# Altium schematic sheet MODULE_CONTROL.SchDoc: MODULE CONTROL
size A3; Author: Silvio Navaretti; CompanyName: ARDUINO; Organization: ARDUINO; SheetNumber: 5; SheetTotal: 51; RevAuthor: Silvio Navaretti
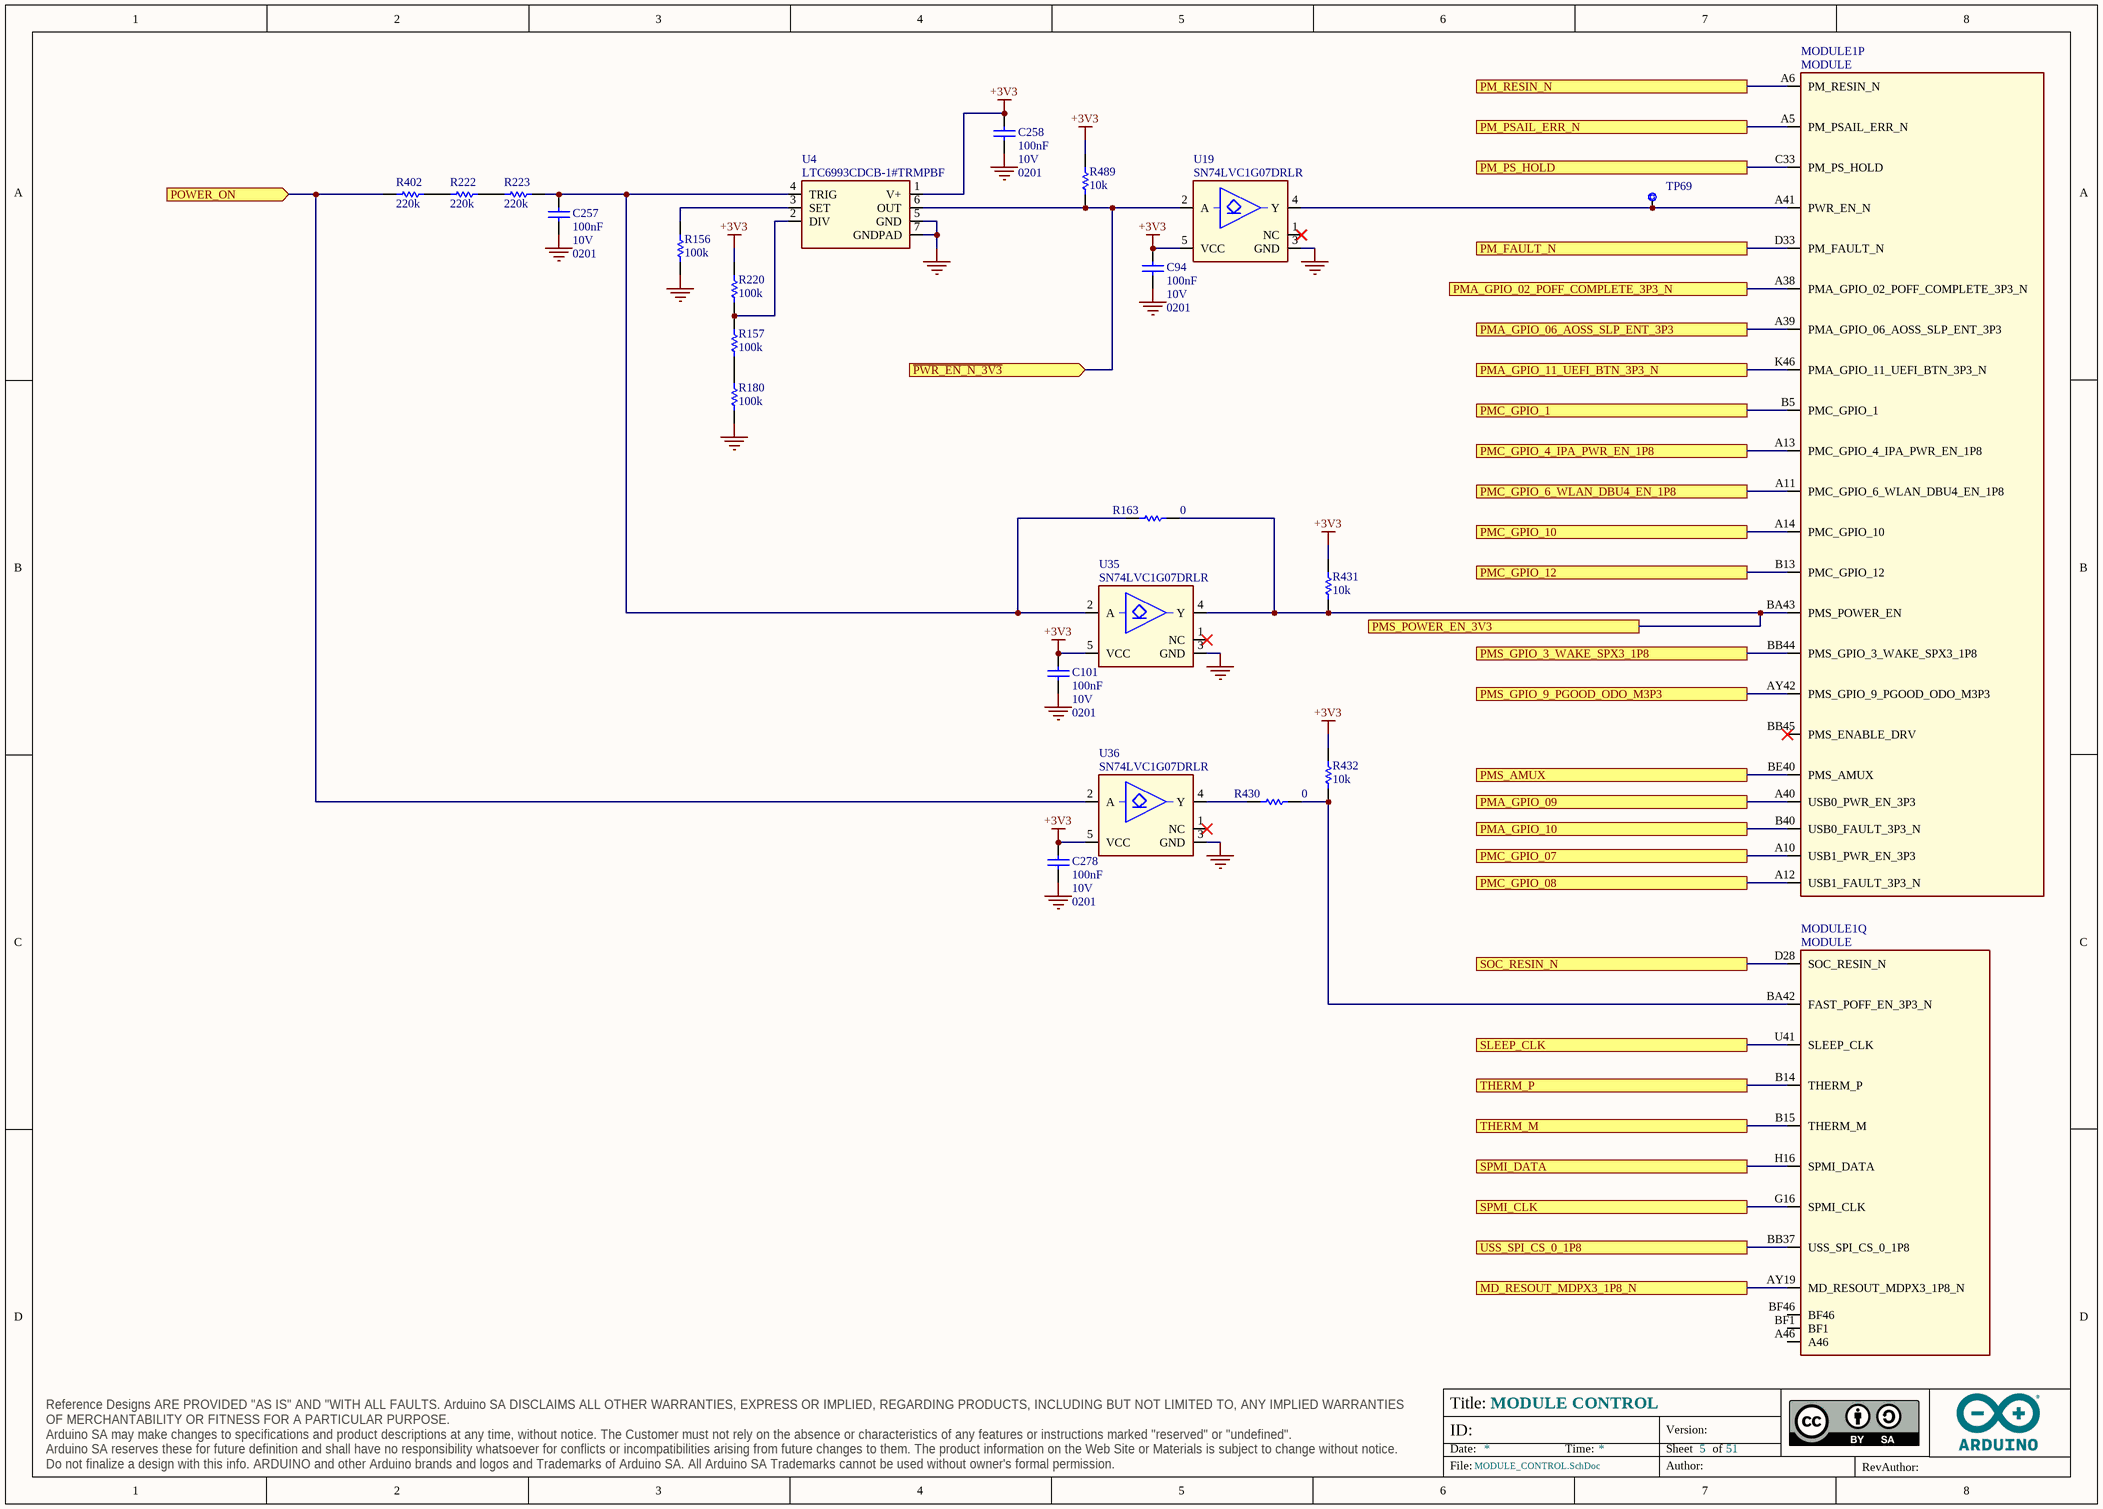
[diagram p0: MODULE_CONTROL.SchDoc]

## Parts
C94  value 100nF  Voltage: 10V  Case Code (Imperial): 0201  [CAP-0201]  (hidden comment: CL03A104KP3NNNC)
C101  value 100nF  Voltage: 10V  Case Code (Imperial): 0201  [CAP-0201]  (hidden comment: CL03A104KP3NNNC)
C257  value 100nF  Voltage: 10V  Case Code (Imperial): 0201  [CAP-0201]  (hidden comment: CL03A104KP3NNNC)
C258  value 100nF  Voltage: 10V  Case Code (Imperial): 0201  [CAP-0201]  (hidden comment: CL03A104KP3NNNC)
C278  value 100nF  Voltage: 10V  Case Code (Imperial): 0201  [CAP-0201]  (hidden comment: CL03A104KP3NNNC)
MODULE1  MODULE  [MODULE]  (parts P,Q of 22)
R156  value 100k  [RES-0201]  (hidden comment: RC0201FR-07100KL)
R157  value 100k  [RES-0201]  (hidden comment: RC0201FR-07100KL)
R163  value 0  [RES-0201]  (hidden comment: CRCW02010000Z0ED)
R180  value 100k  [RES-0201]  (hidden comment: RC0201FR-07100KL)
R220  value 100k  [RES-0201]  (hidden comment: RC0201FR-07100KL)
R222  value 220k  [RES-0201]  (hidden comment: AC0201FR-07220KL)
R223  value 220k  [RES-0201]  (hidden comment: AC0201FR-07220KL)
R402  value 220k  [RES-0201]  (hidden comment: AC0201FR-07220KL)
R430  value 0  [RES-0201]  (hidden comment: CRCW02010000Z0ED)
R431  value 10k  [RES-0201]  (hidden comment: RC0201FR-0710KL)
R432  value 10k  [RES-0201]  (hidden comment: RC0201FR-0710KL)
R489  value 10k  [RES-0201]  (hidden comment: RC0201FR-0710KL)
TP69  Test point 1.00mm  [TP-1.00MM]  (value not drawn)  (no BOM)
U4  LTC6993CDCB-1#TRMPBF  [AD DCB DFN 6 pin 2x3mm pitch 0.5mm]
U19  SN74LVC1G07DRLR  [TI DRL DRL0005A]
U35  SN74LVC1G07DRLR  [TI DRL DRL0005A]
U36  SN74LVC1G07DRLR  [TI DRL DRL0005A]

## Ports
MD_RESOUT_MDPX3_1P8_N, PM_FAULT_N, PM_PS_HOLD, PM_PSAIL_ERR_N, PM_RESIN_N, PMA_GPIO_02_POFF_COMPLETE_3P3_N, PMA_GPIO_06_AOSS_SLP_ENT_3P3, PMA_GPIO_09, PMA_GPIO_10, PMA_GPIO_11_UEFI_BTN_3P3_N, PMC_GPIO_1, PMC_GPIO_4_IPA_PWR_EN_1P8, PMC_GPIO_6_WLAN_DBU4_EN_1P8, PMC_GPIO_07, PMC_GPIO_08, PMC_GPIO_10, PMC_GPIO_12, PMS_AMUX, PMS_GPIO_3_WAKE_SPX3_1P8, PMS_GPIO_9_PGOOD_ODO_M3P3, PMS_POWER_EN_3V3, POWER_ON (in), SLEEP_CLK, SOC_RESIN_N, SPMI_CLK, SPMI_DATA, THERM_M, THERM_P, USS_SPI_CS_0_1P8, ~{PWR_EN_N_3V3} (in)

## Nets
+3V3: C94.2 C101.2 C258.2 C278.2 R220.2 R431.1 R432.1 R489.1 U4.1(V+) U19.5(VCC) U35.5(VCC) U36.5(VCC)
GND: C94.1 C101.1 C257.1 C258.1 C278.1 R156.1 R180.1 U4.5(GND) U4.7(GNDPAD) U19.3(GND) U35.3(GND) U36.3(GND)
MD_RESOUT_MDPX3_1P8_N: MODULE1.AY19(MD_RESOUT_MDPX3_1P8_N) ; port MD_RESOUT_MDPX3_1P8_N
~{PWR_EN_N_3V3}: R489.2 U4.6(OUT) U19.2(A) ; port ~{PWR_EN_N_3V3}
PM_FAULT_N: MODULE1.D33(PM_FAULT_N) ; port PM_FAULT_N
PM_PS_HOLD: MODULE1.C33(PM_PS_HOLD) ; port PM_PS_HOLD
PM_PSAIL_ERR_N: MODULE1.A5(PM_PSAIL_ERR_N) ; port PM_PSAIL_ERR_N
PM_RESIN_N: MODULE1.A6(PM_RESIN_N) ; port PM_RESIN_N
PMA_GPIO_02_POFF_COMPLETE_3P3_N: MODULE1.A38(PMA_GPIO_02_POFF_COMPLETE_3P3_N) ; port PMA_GPIO_02_POFF_COMPLETE_3P3_N
PMA_GPIO_06_AOSS_SLP_ENT_3P3: MODULE1.A39(PMA_GPIO_06_AOSS_SLP_ENT_3P3) ; port PMA_GPIO_06_AOSS_SLP_ENT_3P3
PMA_GPIO_09: MODULE1.A40(USB0_PWR_EN_3P3) ; port PMA_GPIO_09
PMA_GPIO_10: MODULE1.B40(USB0_FAULT_3P3_N) ; port PMA_GPIO_10
PMA_GPIO_11_UEFI_BTN_3P3_N: MODULE1.K46(PMA_GPIO_11_UEFI_BTN_3P3_N) ; port PMA_GPIO_11_UEFI_BTN_3P3_N
PMC_GPIO_1: MODULE1.B5(PMC_GPIO_1) ; port PMC_GPIO_1
PMC_GPIO_4_IPA_PWR_EN_1P8: MODULE1.A13(PMC_GPIO_4_IPA_PWR_EN_1P8) ; port PMC_GPIO_4_IPA_PWR_EN_1P8
PMC_GPIO_6_WLAN_DBU4_EN_1P8: MODULE1.A11(PMC_GPIO_6_WLAN_DBU4_EN_1P8) ; port PMC_GPIO_6_WLAN_DBU4_EN_1P8
PMC_GPIO_07: MODULE1.A10(USB1_PWR_EN_3P3) ; port PMC_GPIO_07
PMC_GPIO_08: MODULE1.A12(USB1_FAULT_3P3_N) ; port PMC_GPIO_08
PMC_GPIO_10: MODULE1.A14(PMC_GPIO_10) ; port PMC_GPIO_10
PMC_GPIO_12: MODULE1.B13(PMC_GPIO_12) ; port PMC_GPIO_12
PMS_AMUX: MODULE1.BE40(PMS_AMUX) ; port PMS_AMUX
PMS_GPIO_3_WAKE_SPX3_1P8: MODULE1.BB44(PMS_GPIO_3_WAKE_SPX3_1P8) ; port PMS_GPIO_3_WAKE_SPX3_1P8
PMS_GPIO_9_PGOOD_ODO_M3P3: MODULE1.AY42(PMS_GPIO_9_PGOOD_ODO_M3P3) ; port PMS_GPIO_9_PGOOD_ODO_M3P3
PMS_POWER_EN_3V3: MODULE1.BA43(PMS_POWER_EN) R163.1 R431.2 U35.4(Y) ; port PMS_POWER_EN_3V3
POWER_ON: R402.2 U36.2(A) ; port POWER_ON
SLEEP_CLK: MODULE1.U41(SLEEP_CLK) ; port SLEEP_CLK
SOC_RESIN_N: MODULE1.D28(SOC_RESIN_N) ; port SOC_RESIN_N
SPMI_CLK: MODULE1.G16(SPMI_CLK) ; port SPMI_CLK
SPMI_DATA: MODULE1.H16(SPMI_DATA) ; port SPMI_DATA
THERM_M: MODULE1.B15(THERM_M) ; port THERM_M
THERM_P: MODULE1.B14(THERM_P) ; port THERM_P
USS_SPI_CS_0_1P8: MODULE1.BB37(USS_SPI_CS_0_1P8) ; port USS_SPI_CS_0_1P8
NetC257_2: C257.2 R163.2 R223.1 U4.4(TRIG) U35.2(A)
NetMODULE1_A41: MODULE1.A41(PWR_EN_N) TP69.X U19.4(Y)
NetMODULE1_BA42: MODULE1.BA42(FAST_POFF_EN_3P3_N) R430.1 R432.2
NetR156_2: R156.2 U4.3(SET)
NetR157_1: R157.1 R180.2
NetR157_2: R157.2 R220.1 U4.2(DIV)
NetR222_1: R222.1 R223.2
NetR222_2: R222.2 R402.1
NetR430_2: R430.2 U36.4(Y)

Not connected (* = marked no-connect by the designer): MODULE1 A46 BB45(PMS_ENABLE_DRV)* BF1 BF46; U19 1(NC)*; U35 1(NC)*; U36 1(NC)*

## Notes on the sheet
- Title:
- ID:
- Date:
- Time:
- Version:
- Sheet
- of
- RevAuthor:
- Reference Designs ARE PROVIDED "AS IS" AND "WITH ALL FAULTS. Arduino SA DISCLAIMS ALL OTHER WARRANTIES, EXPRESS OR IMPLIED, REGARDING PRODUCTS, INCLUDING BUT NOT LIMITED TO, ANY IMPLIED WARRANTIES OF MERCHANTABILITY OR FITNESS FOR A PARTICULAR PURPOSE.
  Arduino SA may make changes to specifications and product descriptions at any time, without notice. The Customer must not rely on the absence or characteristics of any features or instructions marked "reserved" or "undefined".
  Arduino SA reserves these for future definition and shall have no responsibility whatsoever for conflicts or incompatibilities arising from future changes to them. The product information on the Web Site or Materials is subject to change without notice.
  Do not finalize a design with this info. ARDUINO and other Arduino brands and logos and Trademarks of Arduino SA. All Arduino SA Trademarks cannot be used without owner's formal permission.
- File:
- Author:

## Library data of the parts
C94 C101 C257 C258 C278 = C0113-A.6: CAP CHIP 0201 100nF 10% 10V X5R; Manufacturer: Samsung Electro-Mechanics; Code Arduino: C0113; Technology: Ceramic; Part Number: CL03A104KP3NNNC; Dielectric: X5R; Tolerance: 10%
MODULE1 = M0029-A.19: MODULE BGA 1883 balls 57.5x57.5mm; Manufacturer: Qualcomm; Code Arduino: M0029; Part Number: MODULE BGA; Pin Count: 1883
R156 R157 R180 R220 = R0146-A.21: RES CHIP 0201 100k 1% 1/20W; Manufacturer: Yageo; Power: 50mW; Temperature coefficient: 200ppm; Code Arduino: R0146; Manufacturer 2: Samsung Electro-Mechanics; Tolerance: 1%; Case Code (Imperial): 0201; Part Number: RC0201FR-07100KL; Technology: Thick film
R163 R430 = R0140-A.21: RES CHIP 0201 0R; Manufacturer: Vishay; Temperature coefficient: 0ppm; Code Arduino: R0140; Power: 50mW; Tolerance: 0%; Technology: Thick film; Case Code (Imperial): 0201; Part Number: CRCW02010000Z0ED
R222 R223 R402 = R0199-A.20: RES CHIP 0201 220k 1% 1/20W; Manufacturer: Yageo; Temperature coefficient: 200ppm; Power: 50mW; Code Arduino: R0199; Part Number: AC0201FR-07220KL; Tolerance: 1%; Case Code (Imperial): 0201; Technology: Thick film
R431 R432 R489 = R0145-A.21: RES CHIP 0201 10k 1% 1/20W; Manufacturer: Yageo; Power: 50mW; Temperature coefficient: 200ppm; Code Arduino: R0145; Manufacturer 2: Samsung Electro-Mechanics; Tolerance: 1%; Case Code (Imperial): 0201; Part Number: RC0201FR-0710KL; Technology: Thick film
TP69 = UT0013-A.6: Part Number: This is not a component; Design Item ID: CMP-018-0005-A.3; Source: ut.SchLib; Manufacturer: This is not a component; Code Arduino: This is not a component; Pin Count: 1
U4 = U0524-A.1: IC monostable multivibrator programmable pulse 1us to 33.6 DFN6 2x3mm; Manufacturer: Analog Devices; Code Arduino: U0524; Part Number: LTC6993CDCB-1#TRMPBF
U19 U35 U36 = U0494-A.2: IC buffer open drain, 1.65V to 5.5V, 32mA sink current, SOT-5X3 1.6mmx1.6mm; Manufacturer: Texas Instruments; Code Arduino: U0494; Part Number: SN74LVC1G07DRLR